# EAGLE design armboard (EAGLE 8.0.0)
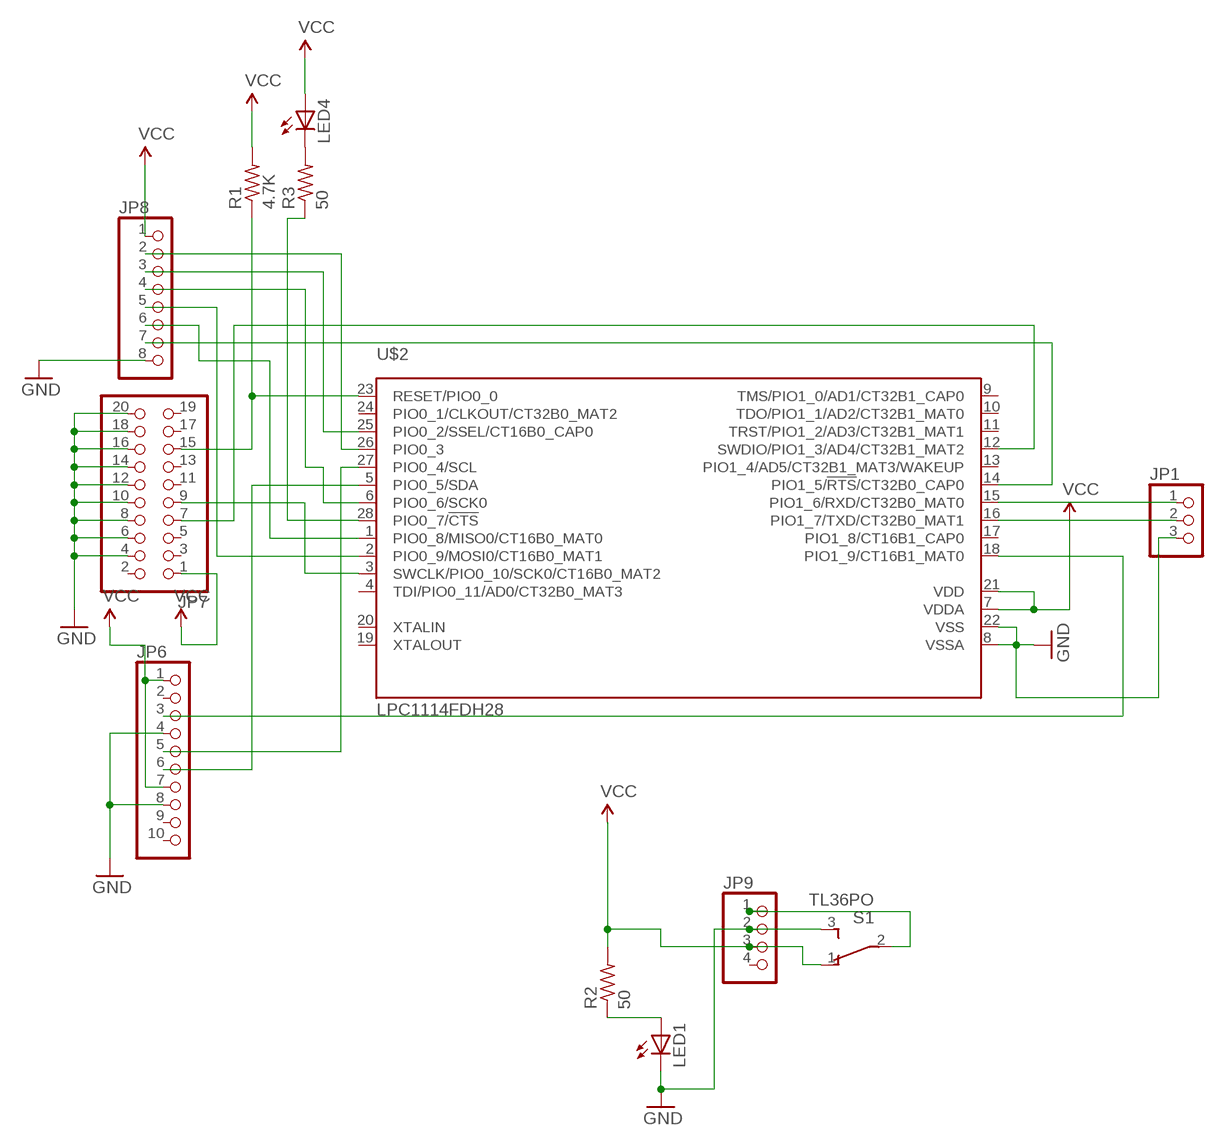
[diagram p0: schematic, sheet 1]

## Parts
JP1  PINHD-1X3  [1X03]
JP6  PINHD-1X10  [1X10]
JP7  PINHD-2X10  [2X10]
JP8  PINHD-1X8  [1X08]
JP9  PINHD-1X4  [1X04]
LED1  LED5MM  [LED5MM]
LED4  LED5MM  [LED5MM]
R1  4.7K  R-US_0207/10  [0207/10]
R2  50  R-US_0207/10  [0207/10]
R3  50  R-US_0207/10  [0207/10]
S1  TL36PO  [TL3XPO]
U$2  LPC1114FDH28  [SOT361-1]

## Nets
GND: JP1.3 JP6.4 JP6.8 JP7.4 JP7.6 JP7.8 JP7.10 JP7.12 JP7.14 JP7.16 JP7.18 JP7.20 JP8.8 JP9.2 LED1.K(C) S1.3(S) U$2.8(VSSA) U$2.22(VSS)
N$1: JP7.15 R1.1 U$2.23(RESET/PIO0_0)
N$2: JP9.1 S1.2(P)
N$3: LED4.K(C) R3.2
N$4: R3.1 U$2.28(PIO0_7/!CTS!)
N$5: JP7.9 U$2.3(SWCLK/PIO0_10/SCK0/CT16B0_MAT2)
N$6: JP8.6 U$2.1(PIO0_8/MISO0/CT16B0_MAT0)
N$7: JP1.1 U$2.15(PIO1_6/RXD/CT32B0_MAT0)
N$8: JP8.5 U$2.2(PIO0_9/MOSI0/CT16B0_MAT1)
N$9: JP8.3 U$2.25(PIO0_2/SSEL/CT16B0_CAP0)
N$11: JP6.6 U$2.5(PIO0_5/SDA)
N$12: JP8.2 U$2.26(PIO0_3)
N$13: JP1.2 U$2.16(PIO1_7/TXD/CT32B0_MAT1)
N$18: JP6.3 U$2.18(PIO1_9/CT16B1_MAT0)
N$22: JP8.4 U$2.6(PIO0_6/SCK0)
N$27: LED1.A R2.1
N$29: JP8.7 U$2.14(PIO1_5/!RTS!/CT32B0_CAP0)
N$30: JP6.5 U$2.27(PIO0_4/SCL)
N$31: JP7.7 U$2.12(SWDIO/PIO1_3/AD4/CT32B1_MAT2)
VCC: JP6.1 JP6.7 JP7.1 JP8.1 JP9.3 LED4.A R1.2 R2.2 S1.1(O) U$2.7(VDDA) U$2.21(VDD)
Unconnected: JP6.2 JP6.9 JP6.10 JP7.2 JP7.3 JP7.5 JP7.11 JP7.13 JP7.17 JP7.19 JP9.4 U$2.4(TDI/PIO0_11/AD0/CT32B0_MAT3) U$2.9(TMS/PIO1_0/AD1/CT32B1_CAP0) U$2.10(TDO/PIO1_1/AD2/CT32B1_MAT0) U$2.11(TRST/PIO1_2/AD3/CT32B1_MAT1) U$2.13(PIO1_4/AD5/CT32B1_MAT3/WAKEUP) U$2.17(PIO1_8/CT16B1_CAP0) U$2.19(XTALOUT) U$2.20(XTALIN) U$2.24(PIO0_1/CLKOUT/CT32B0_MAT2)

## Library data of the parts
JP1 = pinhead:PINHD-1X3: PIN HEADER
JP6 = pinhead:PINHD-1X10: PIN HEADER
JP7 = pinhead:PINHD-2X10: PIN HEADER
JP8 = pinhead:PINHD-1X8: PIN HEADER
JP9 = pinhead:PINHD-1X4: PIN HEADER
LED1 LED4 = led:LED: LED OSRAM: - CHIPLED LG R971, LG N971, LY N971, LG Q971, LY Q971, LO R971, LY R971 LH N974, LH R974 LS Q976, LO Q976, LY Q976 LO Q996 - Hyper CHIPLED LW Q18S LB Q993, LB Q99A, LB R99A - SideLED LS A670, LO A670, LY A670, LG A670, LP A670 LB A673, LV A673, LT A673, LW A673 LH A674 LY A675 LS A676, LA A676, LO A676, LY A676, LW A676 LS A679, LY A679, LG A679 - Hyper Micro SIDELED® LS Y876, LA Y876, LO Y876, LY Y876 LT Y87S - SmartLED LW L88C, LW L88S LB L89C, LB L89S, LG L890 LS L89K, LO L89K, LY L89K LS L896, LA L896, LO L896, LY L896 - TOPLED LS T670, LO T670, LY T670, LG T670, LP T670 LSG T670, LSP T670, LSY T670, LOP T670, LYG T670 LG T671, LOG T671, LSG T671 LB T673, LV T673, LT T673, LW T673 LH T674 LS T676, LA T676, LO T676, LY T676, LB T676, LH T676, LSB T676, LW T676 LB T67C, LV T67C, LT T67C, LS T67K, LO T67K, LY T67K, LW E67C LS E67B, LA E67B, LO E67B, LY E67B, LB E67C, LV E67C, LT E67C LW T67C LS T679, LY T679, LG T679 LS T770, LO T770, LY T770, LG T770, LP T770 LB T773, LV T773, LT T773, LW T773 LH T774 LS E675, LA E675, LY E675, LS T675 LS T776, LA T776, LO T776, LY T776, LB T776 LHGB T686 LT T68C, LB T68C - Hyper Mini TOPLED® LB M676 - Mini TOPLED Santana® LG M470 LS M47K, LO M47K, LY M47K Source: http://www.osram.convergy.de LUXEON: - LUMILED® LXK2-PW12-R00, LXK2-PW12-S00, LXK2-PW14-U00, LXK2-PW14-V00 LXK2-PM12-R00, LXK2-PM12-S00, LXK2-PM14-U00 LXK2-PE12-Q00, LXK2-PE12-R00, LXK2-PE12-S00, LXK2-PE14-T00, LXK2-PE14-U00 LXK2-PB12-K00, LXK2-PB12-L00, LXK2-PB12-M00, LXK2-PB14-N00, LXK2-PB14-P00, LXK2-PB14-Q00 LXK2-PR12-L00, LXK2-PR12-M00, LXK2-PR14-Q00, LXK2-PR14-R00 LXK2-PD12-Q00, LXK2-PD12-R00, LXK2-PD12-S00 LXK2-PH12-R00, LXK2-PH12-S00 LXK2-PL12-P00, LXK2-PL12-Q00, LXK2-PL12-R00 Source: www.luxeon.com KINGBRIGHT: KA-3528ASYC Source: www.kingbright.com
R1-R3 = resistor:R-US_: RESISTOR, American symbol
S1 = switch:TL36PO: TINY SWITCH ON - ON Source: http://www2.produktinfo.conrad.com/datenblaetter/700000-724999/705152-da-01-de-Subminiaturschalter_TL_36YO.pdf
U$2 = nxp_60:LPC1114FDH28: LPC1114 50 MHz 32-bit ARM Cortex-M0 based microcontroller featuring a high level of integration and very low power consumption. On-chip flash program memory The LPC1110/11/12/13/14 contain 32 kB (LPC1114), 24 kB (LPC1113), 16 kB (LPC1112), 8 kB (LPC1111),or 4 kB (LPC1110) of on-chip flash memory. On-chip SRAM The LPC1110/11/12/13/14 contain a total of 8 kB, 4 kB, 2 kB, or 1 kB on-chip static RAM memory. MK - Datasheet available on www.nxp.com

## Board
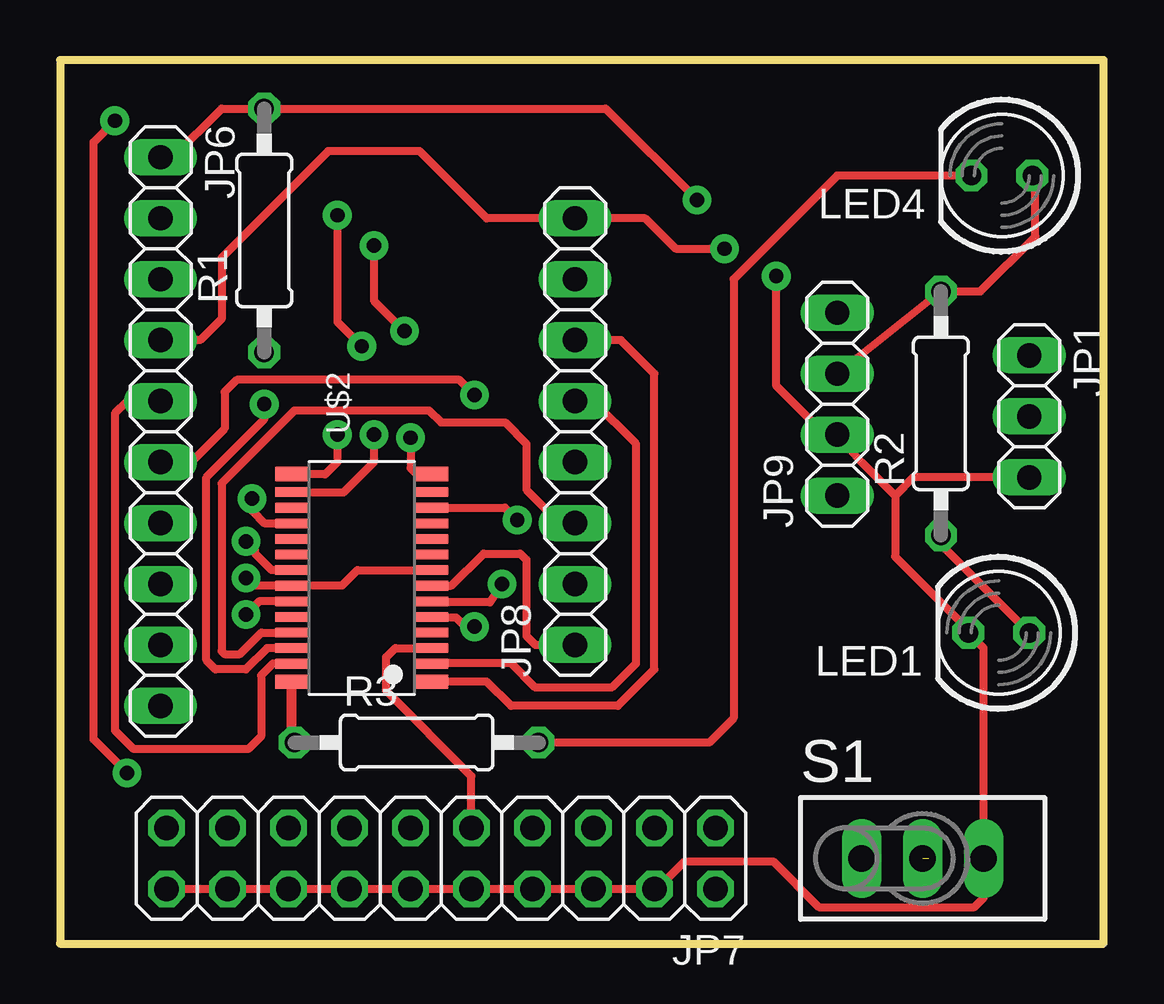
[diagram p1: board, top side]
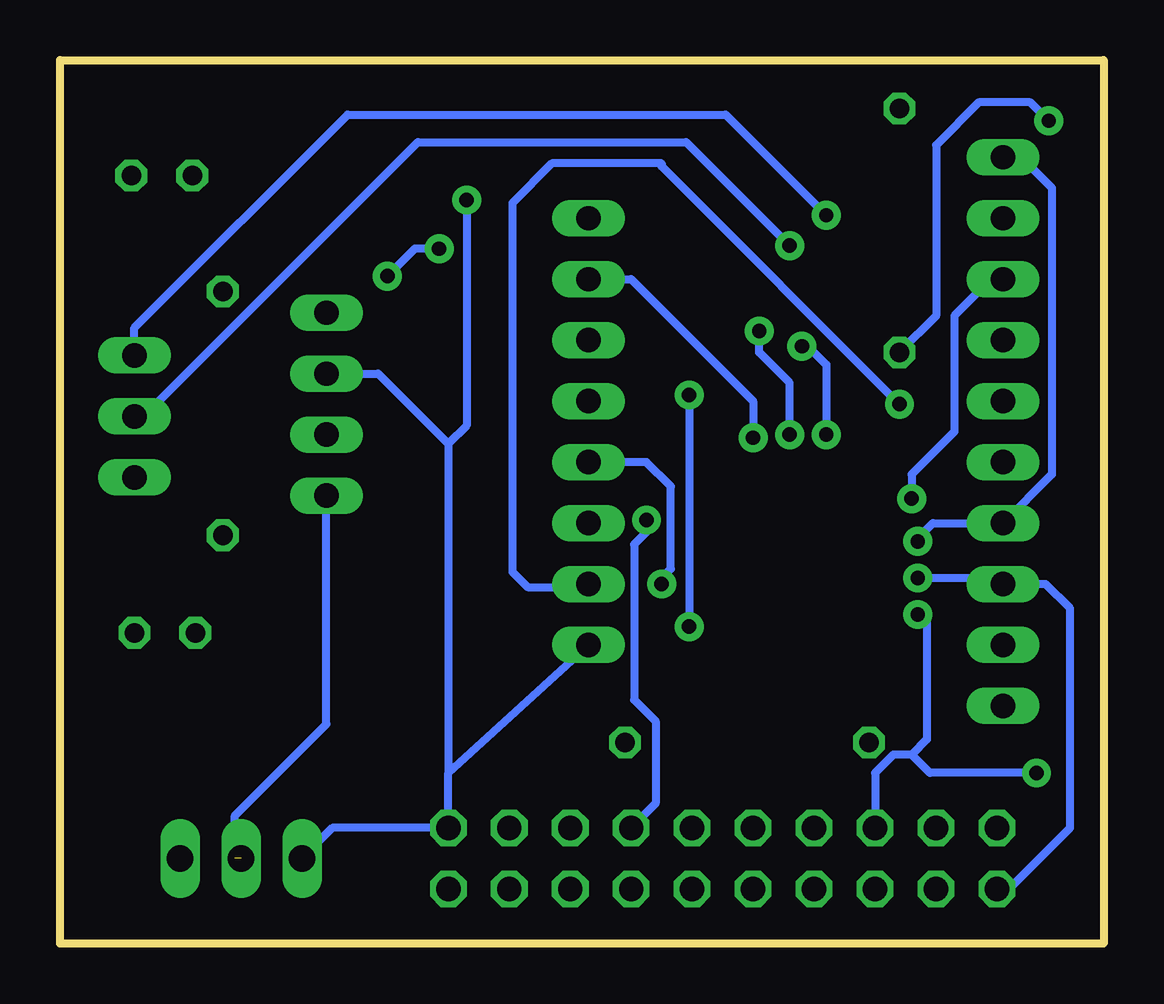
[diagram p2: board, bottom side, seen from below]

Size 43.48 x 36.82 mm. Coordinates in mm from the lower left corner, seen from the top.
Outline: 0,0 43.48,0 43.48,36.82 0,36.82 0,0
Copper layers (1*16): Top 0.035mm / dielectric 1.5mm / Bottom 0.035mm
Design rules "MWSEagleDesignRules3": minimum track width 13mil, minimum drill 22mil, track to track 8.5mil, track to pad 8.5mil, pad to pad 8.5mil, via to via 8.5mil, smd to smd 8mil, copper to edge 40mil, drill to drill 8mil, minimum pad ring 10mil, minimum via ring 8mil, stop-mask expansion 4mil, vias tented up to drill 0mil, thermal gap 10mil

### Footprints (pad centres in the part's own frame; a part is rotated, then mirrored left to right if it is on the bottom)
1X03 = drill 1.016 long: 1 -2.54,0; 2 0,0; 3 2.54,0
1X10 = drill 1.016 long: 1 -11.43,0; 2 -8.89,0; 3 -6.35,0; 4 -3.81,0; 5 -1.27,0; 6 1.27,0; 7 3.81,0; 8 6.35,0; 9 8.89,0; 10 11.43,0
2X10 = drill 1.016 octagon: 1 -11.43,-1.27; 2 -11.43,1.27; 3 -8.89,-1.27; 4 -8.89,1.27; 5 -6.35,-1.27; 6 -6.35,1.27; 7 -3.81,-1.27; 8 -3.81,1.27; 9 -1.27,-1.27; 10 -1.27,1.27; 11 1.27,-1.27; 12 1.27,1.27; 13 3.81,-1.27; 14 3.81,1.27; 15 6.35,-1.27; 16 6.35,1.27; 17 8.89,-1.27; 18 8.89,1.27; 19 11.43,-1.27; 20 11.43,1.27
1X08 = drill 1.016 long: 1 -8.89,0; 2 -6.35,0; 3 -3.81,0; 4 -1.27,0; 5 1.27,0; 6 3.81,0; 7 6.35,0; 8 8.89,0
1X04 = drill 1.016 long: 1 -3.81,0; 2 -1.27,0; 3 1.27,0; 4 3.81,0
LED5MM = drill 0.813 octagon: A -1.27,0; K 1.27,0
0207/10 = drill 0.813 octagon: 1 -5.08,0; 2 5.08,0
TL3XPO = drill 1.1 pad 1.422 long: 1 -2.54,0; 2 0,0; 3 2.54,0
SOT361-1 = smd 0.6 x 1.35: 1 -4.325,-2.925; 14 4.325,-2.925; 15 4.325,2.925; 28 -4.325,2.925 | smd 0.4 x 1.35: 2 -3.575,-2.925; 3 -2.925,-2.925; 4 -2.275,-2.925; 5 -1.625,-2.925; 6 -0.975,-2.925; 7 -0.325,-2.925; 8 0.325,-2.925; 9 0.975,-2.925; 10 1.625,-2.925; 11 2.275,-2.925; 12 2.925,-2.925; 13 3.575,-2.925; 16 3.575,2.925; 17 2.925,2.925; 18 2.275,2.925; 19 1.625,2.925; 20 0.975,2.925; 21 0.325,2.925; 22 -0.325,2.925; 23 -0.975,2.925; 24 -1.625,2.925; 25 -2.275,2.925; 26 -2.925,2.925; 27 -3.575,2.925

### Placement (x,y rotation side)
JP1  40.39,21.97 270 top
JP6  4.19,21.34 270 top
JP7  15.88,3.56 180 top
JP8  21.46,21.34 90 top
JP9  32.39,22.48 90 top
LED1  39.12,12.95 180 top
LED4  39.24,32 180 top
R1  8.51,29.72 90 top
R2  36.7,22.1 90 top
R3  14.86,8.38 0 top
S1  35.94,3.56 0 top
U$2  12.57,15.24 90 top

### Tracks (layer width: path | path; a pad name or v marks a point on that pad's centre or on a via)
GND  (via drill 0.6)
  Top 0.33: JP7.20 JP7.18 JP7.16 JP7.14 JP7.12 JP7.10 JP7.8 JP7.6 JP7.4 24.89,2.29 26.04,3.43 29.72,3.43 31.62,1.52 38.1,1.52 38.48,1.91 S1.3 38.48,12.32 LED1.K 37.85,13.08 34.8,16.13 34.8,18.67 | 34.8,18.67 33.4,20.07 JP9.2 31.88,21.21 29.84,23.24 v29.84,27.81 | v27.69,28.96 25.65,28.96 24.38,30.23 JP8.8 17.78,30.23 14.99,33.02 11.18,33.02 6.73,28.58 6.73,26.04 5.84,25.15 JP6.4 | U$2.8 12.39,15.57 11.74,14.91 U$2.22 8.07,14.91 v7.75,15.24 | JP1.3 35.56,19.43 34.8,18.67
  Bottom 0.33: v27.69,28.96 28.7,28.96 v29.84,27.81 | 4.19,2.29 JP7.20 3.94,2.29 1.4,4.83 1.4,13.97 2.41,14.99 JP6.8 4.45,15.24 v7.75,15.24
N$1  (via drill 0.6)
  Top 0.33: 9.61,14.22 U$2.23 8.3,14.27 v7.75,13.72 | v2.79,7.11 1.4,8.51 1.4,33.4 v2.29,34.29
  Bottom 0.33: 8,7.87 8.76,7.87 9.52,7.11 JP7.15 | R1.1 6.98,26.16 6.98,33.27 5.21,35.05 3.05,35.05 v2.29,34.29 | v2.79,7.11 7.24,7.11 8,7.87 | v7.75,13.72 7.37,13.34 7.37,8.51 8,7.87
N$2  (1 unrouted)
  Bottom 0.33: 36.2,3.56 36.2,5.33 32.39,9.14 JP9.1
N$3
  Top 0.33: R3.2 27.05,8.38 28.07,9.4 28.07,27.69 32.39,32 LED4.K
N$4
  Top 0.406: R3.1 9.65,8.38 U$2.28
N$5
  Top 0.33: JP7.9 17.15,6.99 13.59,10.54 13.59,11.94 13.97,12.32 U$2.3
N$6
  Top 0.33: U$2.1 | JP8.6 23.37,25.15 24.77,23.75 24.77,11.43 23.24,9.91 18.8,9.91 17.78,10.92 U$2.1
N$7  (via drill 0.6)
  Top 0.33: v11.56,30.35 11.56,25.91 v12.57,24.89 | v11.56,21.21 11.56,20.07 11.05,19.56 U$2.15
  Bottom 0.33: v11.56,30.35 15.75,34.54 31.5,34.54 40.39,25.65 JP1.1 | v12.57,24.89 12.32,24.89 11.56,24.13 v11.56,21.21
N$8
  Top 0.33: JP8.5 22.23,22.61 24,20.83 24,11.68 22.99,10.67 19.81,10.67 18.8,11.68 15.52,11.68 U$2.2
N$9
  Top 0.33: 9.64,12.95 U$2.25 8.39,12.96 7.49,12.07 6.86,12.07 6.73,12.19 6.73,19.18 9.78,22.23 15.37,22.23 15.88,21.72 18.54,21.72 19.43,20.83 19.43,18.92 20.83,17.53 JP8.3
N$11  (via drill 0.6)
  Top 0.33: JP6.6 5.46,20.07 6.86,21.46 6.86,22.99 7.37,23.5 16.64,23.5 v17.27,22.86 | 15.52,13.59 U$2.5 15.52,13.59 | v17.27,13.21 16.89,13.21 16.51,13.59 15.52,13.59
  Bottom 0.33: v17.27,22.86 v17.27,13.21
N$12  (via drill 0.6)
  Top 0.33: v8.51,22.48 8.51,21.84 6.1,19.43 6.1,11.81 6.22,11.68 | U$2.26 8.63,12.32 7.75,11.43 6.48,11.43 | 6.22,11.68 6.48,11.43 | 6.48,11.43 6.22,11.68
  Bottom 0.33: v8.51,22.48 18.41,32.38 18.41,32.51 22.99,32.51 24.64,30.86 24.64,15.49 24,14.86 22.1,14.86 JP8.2
N$13  (via drill 0.6)
  Top 0.33: v13.08,29.08 13.08,26.8 v14.35,25.53 | v13.08,21.21 13.08,20.07 11.81,18.8 9.67,18.8 U$2.16
  Bottom 0.33: v14.35,25.53 14.35,24.64 13.08,23.37 v13.08,21.21 | v13.08,29.08 17.4,33.4 28.58,33.4 40,21.97 JP1.2
N$18  (via drill 0.6)
  Top 0.33: U$2.18 9.64,17.53 8.51,17.53 8,18.03 v8,18.54
  Bottom 0.33: JP6.3 4.7,27.69 6.22,26.16 6.22,21.34 8,19.56 v8,18.54
N$22  (via drill 0.6)
  Top 0.33: 15.88,14.22 15.83,14.27 U$2.6 15.54,14.22 17.91,14.22 v18.41,14.99
  Bottom 0.33: JP8.4 19.05,20.07 18.03,19.05 18.03,15.62 18.41,15.24 v18.41,14.99
N$27
  Top 0.33: R2.1 36.7,16.64 LED1.A
N$29  (via drill 0.6)
  Top 0.33: U$2.14 15.12,19.57 14.99,19.43 14.61,19.81 v14.61,21.08
  Bottom 0.33: JP8.7 19.69,27.69 14.61,22.61 v14.61,21.08
N$30
  Top 0.33: 9.63,11.68 U$2.27 8.87,11.66 8.38,11.18 8.38,8.64 7.87,8.13 3.05,8.13 2.29,8.89 2.29,22.1 2.79,22.61 JP6.5
N$31  (via drill 0.6)
  Top 0.33: U$2.12 18.54,18.16 v19.05,17.65
  Bottom 0.33: v19.05,17.65 19.05,17.14 19.56,16.64 19.56,10.16 18.67,9.27 18.67,5.84 JP7.7
VCC  (via drill 0.6)
  Top 0.33: JP6.1 4.7,32.77 6.73,34.8 R1.2 22.73,34.8 v26.54,30.99 | JP9.3 R2.2 38.35,27.18 40.64,29.46 40.64,31.88 LED4.A | U$2.7 16.31,14.91 17.65,16.26 19.18,16.26 19.43,16 19.43,12.83 19.81,12.45 JP8.1 | U$2.21 8.82,15.57 8.13,16.26 8.13,16.38 v7.75,16.76
  Bottom 0.33: JP6.1 3.43,32.77 2.16,31.5 2.16,19.56 JP6.7 7.11,17.53 7.75,16.89 v7.75,16.76 | S1.1 32.13,4.83 JP7.1 27.3,7.11 | 27.3,7.11 JP8.1 | 27.3,20.83 27.3,7.11 | v26.54,30.99 26.54,21.59 27.3,20.83 | JP9.3 30.23,23.75 27.3,20.83